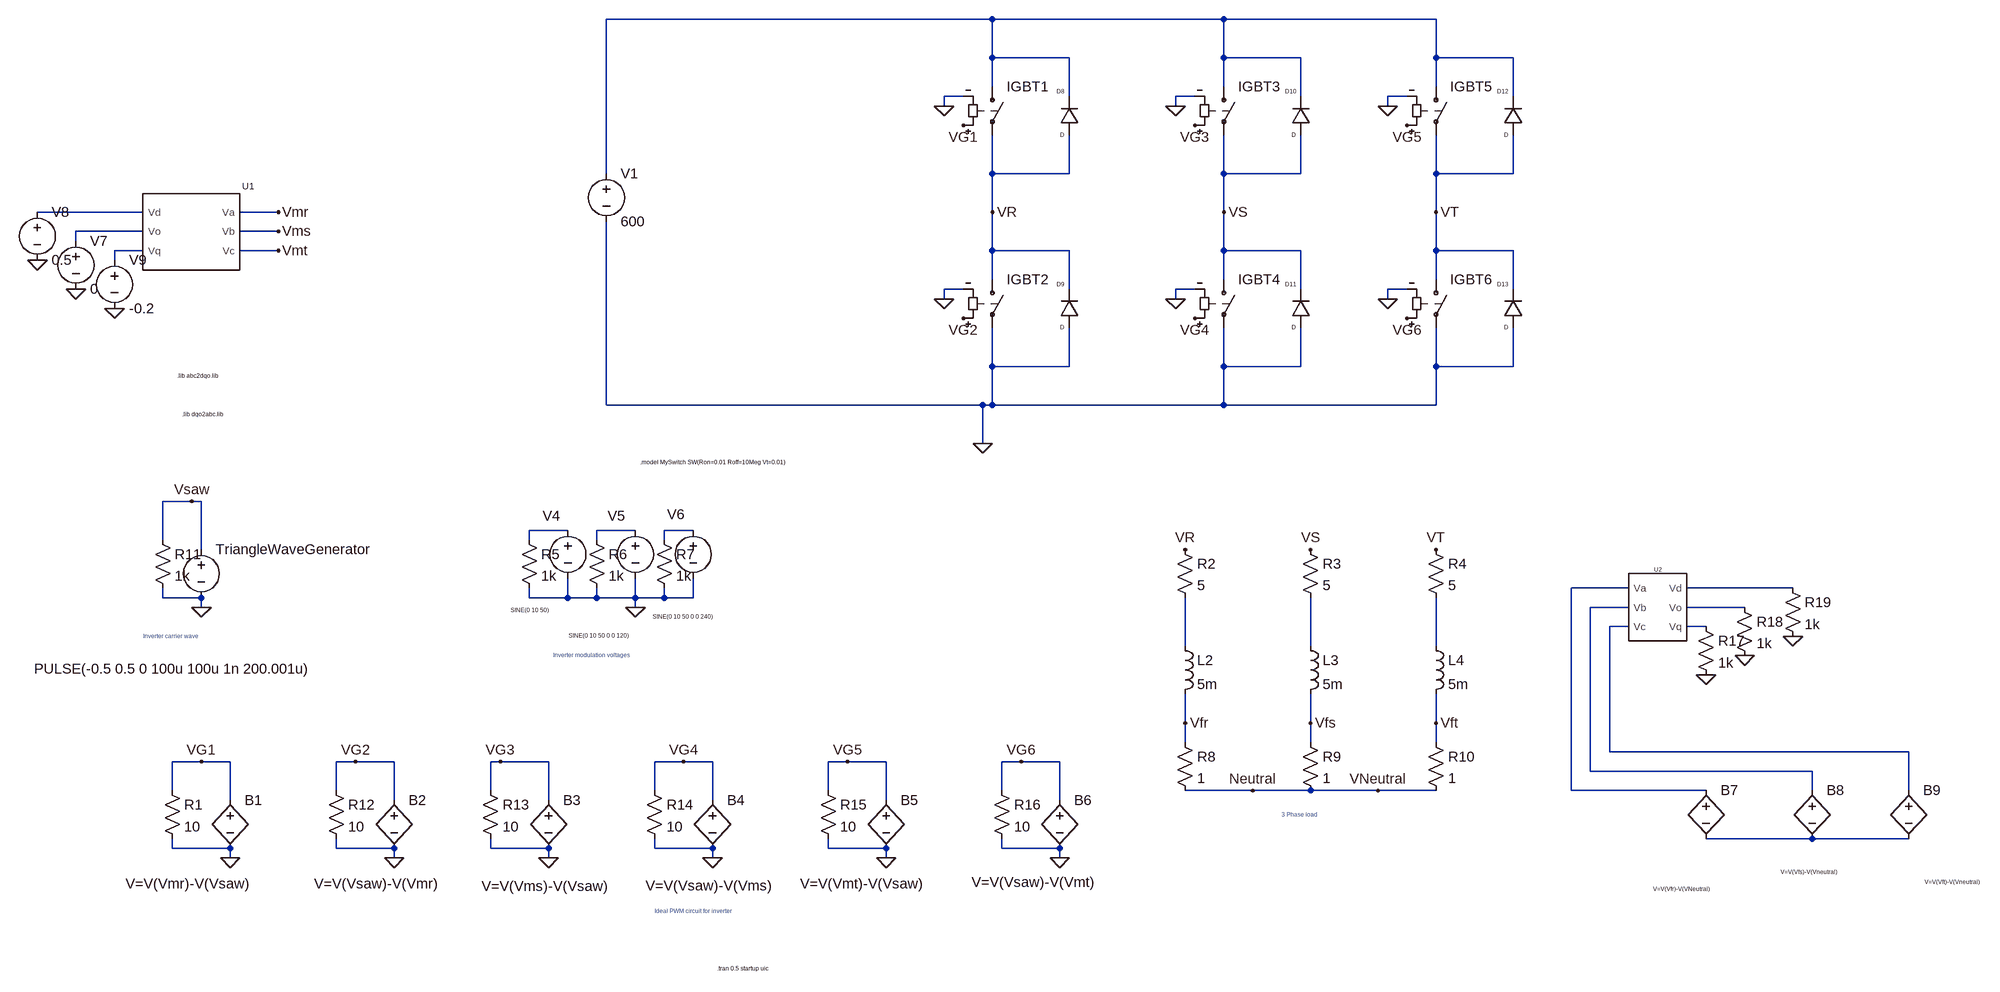
[diagram p0: schematic dqoabc_abcdqo_inverter1.asc]
dqoabc_abcdqo_inverter1.asc, the LTspice schematic file:
Version 4
SHEET 1 3872 1864
WIRE 1456 -32 816 -32
WIRE 1840 -32 1456 -32
WIRE 2192 -32 1840 -32
WIRE 1456 32 1456 -32
WIRE 1584 32 1456 32
WIRE 1840 32 1840 -32
WIRE 1968 32 1840 32
WIRE 2192 32 2192 -32
WIRE 2320 32 2192 32
WIRE 1456 80 1456 32
WIRE 1840 80 1840 32
WIRE 2192 80 2192 32
WIRE 1408 96 1376 96
WIRE 1584 96 1584 32
WIRE 1792 96 1760 96
WIRE 1968 96 1968 32
WIRE 2144 96 2112 96
WIRE 2320 96 2320 32
WIRE 1376 112 1376 96
WIRE 1760 112 1760 96
WIRE 2112 112 2112 96
WIRE 816 224 816 -32
WIRE 1456 224 1456 160
WIRE 1584 224 1584 160
WIRE 1584 224 1456 224
WIRE 1840 224 1840 160
WIRE 1968 224 1968 160
WIRE 1968 224 1840 224
WIRE 2192 224 2192 160
WIRE 2320 224 2320 160
WIRE 2320 224 2192 224
WIRE 48 288 -128 288
WIRE 272 288 208 288
WIRE 1456 288 1456 224
WIRE 1840 288 1840 224
WIRE 2192 288 2192 224
WIRE 48 320 -64 320
WIRE 272 320 208 320
WIRE -64 336 -64 320
WIRE 48 352 0 352
WIRE 272 352 208 352
WIRE 1456 352 1456 288
WIRE 1584 352 1456 352
WIRE 1840 352 1840 288
WIRE 1968 352 1840 352
WIRE 2192 352 2192 288
WIRE 2320 352 2192 352
WIRE 0 368 0 352
WIRE 1456 400 1456 352
WIRE 1840 400 1840 352
WIRE 2192 400 2192 352
WIRE 1408 416 1376 416
WIRE 1584 416 1584 352
WIRE 1792 416 1760 416
WIRE 1968 416 1968 352
WIRE 2144 416 2112 416
WIRE 2320 416 2320 352
WIRE 1376 432 1376 416
WIRE 1760 432 1760 416
WIRE 2112 432 2112 416
WIRE 1456 544 1456 480
WIRE 1584 544 1584 480
WIRE 1584 544 1456 544
WIRE 1840 544 1840 480
WIRE 1968 544 1968 480
WIRE 1968 544 1840 544
WIRE 2192 544 2192 480
WIRE 2320 544 2320 480
WIRE 2320 544 2192 544
WIRE 816 608 816 304
WIRE 1440 608 816 608
WIRE 1456 608 1456 544
WIRE 1456 608 1440 608
WIRE 1840 608 1840 544
WIRE 1840 608 1456 608
WIRE 2192 608 2192 544
WIRE 2192 608 1840 608
WIRE 1440 672 1440 608
WIRE 128 768 80 768
WIRE 144 768 128 768
WIRE 752 816 688 816
WIRE 864 816 800 816
WIRE 960 816 912 816
WIRE 80 832 80 768
WIRE 688 832 688 816
WIRE 800 832 800 816
WIRE 912 832 912 816
WIRE 144 848 144 768
WIRE 2512 912 2416 912
WIRE 2784 912 2608 912
WIRE 80 928 80 912
WIRE 144 928 80 928
WIRE 688 928 688 912
WIRE 752 928 752 896
WIRE 752 928 688 928
WIRE 800 928 800 912
WIRE 800 928 752 928
WIRE 864 928 864 896
WIRE 864 928 800 928
WIRE 912 928 912 912
WIRE 912 928 864 928
WIRE 960 928 960 896
WIRE 960 928 912 928
WIRE 144 944 144 928
WIRE 864 944 864 928
WIRE 2512 944 2448 944
WIRE 2704 944 2608 944
WIRE 2512 976 2480 976
WIRE 2640 976 2608 976
WIRE 1776 1008 1776 928
WIRE 1984 1008 1984 928
WIRE 2192 1008 2192 928
WIRE 1776 1136 1776 1088
WIRE 1984 1136 1984 1088
WIRE 2192 1136 2192 1088
WIRE 1776 1168 1776 1136
WIRE 1984 1168 1984 1136
WIRE 2192 1168 2192 1136
WIRE 2480 1184 2480 976
WIRE 2976 1184 2480 1184
WIRE 144 1200 96 1200
WIRE 192 1200 144 1200
WIRE 400 1200 368 1200
WIRE 464 1200 400 1200
WIRE 640 1200 624 1200
WIRE 720 1200 640 1200
WIRE 944 1200 896 1200
WIRE 992 1200 944 1200
WIRE 1216 1200 1184 1200
WIRE 1280 1200 1216 1200
WIRE 1504 1200 1472 1200
WIRE 1568 1200 1504 1200
WIRE 2448 1216 2448 944
WIRE 2816 1216 2448 1216
WIRE 96 1248 96 1200
WIRE 368 1248 368 1200
WIRE 624 1248 624 1200
WIRE 896 1248 896 1200
WIRE 1184 1248 1184 1200
WIRE 1472 1248 1472 1200
WIRE 1888 1248 1776 1248
WIRE 1984 1248 1888 1248
WIRE 2096 1248 1984 1248
WIRE 2192 1248 2096 1248
WIRE 2416 1248 2416 912
WIRE 2640 1248 2416 1248
WIRE 2816 1248 2816 1216
WIRE 2976 1248 2976 1184
WIRE 192 1264 192 1200
WIRE 464 1264 464 1200
WIRE 720 1264 720 1200
WIRE 992 1264 992 1200
WIRE 1280 1264 1280 1200
WIRE 1568 1264 1568 1200
WIRE 2816 1328 2640 1328
WIRE 2976 1328 2816 1328
WIRE 96 1344 96 1328
WIRE 192 1344 96 1344
WIRE 368 1344 368 1328
WIRE 464 1344 368 1344
WIRE 624 1344 624 1328
WIRE 720 1344 624 1344
WIRE 896 1344 896 1328
WIRE 992 1344 896 1344
WIRE 1184 1344 1184 1328
WIRE 1280 1344 1184 1344
WIRE 1472 1344 1472 1328
WIRE 1568 1344 1472 1344
WIRE 192 1360 192 1344
WIRE 464 1360 464 1344
WIRE 720 1360 720 1344
WIRE 992 1360 992 1344
WIRE 1280 1360 1280 1344
WIRE 1568 1360 1568 1344
FLAG 1376 112 0
FLAG 1408 144 VG1
FLAG 1376 432 0
FLAG 1408 464 VG2
FLAG 1760 112 0
FLAG 1792 144 VG3
FLAG 1760 432 0
FLAG 1792 464 VG4
FLAG 2112 112 0
FLAG 2144 144 VG5
FLAG 2112 432 0
FLAG 2144 464 VG6
FLAG 1456 288 VR
FLAG 1840 288 VS
FLAG 2192 288 VT
FLAG 1776 848 VR
FLAG 1984 848 VS
FLAG 2192 848 VT
FLAG 1888 1248 Neutral
FLAG 144 944 0
FLAG 128 768 Vsaw
FLAG 272 288 Vmr
FLAG 272 320 Vms
FLAG 272 352 Vmt
FLAG 144 1200 VG1
FLAG 400 1200 VG2
FLAG 640 1200 VG3
FLAG 944 1200 VG4
FLAG 1216 1200 VG5
FLAG 1504 1200 VG6
FLAG 864 944 0
FLAG 192 1360 0
FLAG 464 1360 0
FLAG 720 1360 0
FLAG 992 1360 0
FLAG 1280 1360 0
FLAG 1568 1360 0
FLAG -128 368 0
FLAG -64 416 0
FLAG 0 448 0
FLAG 1776 1136 Vfr
FLAG 1984 1136 Vfs
FLAG 2192 1136 Vft
FLAG 2640 1056 0
FLAG 2704 1024 0
FLAG 2784 992 0
FLAG 2096 1248 VNeutral
FLAG 1440 672 0
SYMBOL sw 1456 64 R0
SYMATTR InstName IGBT1
SYMATTR Value ""
SYMATTR SpiceModel MySwitch
SYMBOL diode 1600 160 R180
WINDOW 0 24 72 Left 0
WINDOW 3 24 0 Left 0
SYMATTR InstName D8
SYMBOL sw 1456 384 R0
SYMATTR InstName IGBT2
SYMATTR Value ""
SYMATTR SpiceModel MySwitch
SYMBOL diode 1600 480 R180
WINDOW 0 24 72 Left 0
WINDOW 3 24 0 Left 0
SYMATTR InstName D9
SYMBOL sw 1840 64 R0
SYMATTR InstName IGBT3
SYMATTR Value ""
SYMATTR SpiceModel MySwitch
SYMBOL diode 1984 160 R180
WINDOW 0 24 72 Left 0
WINDOW 3 24 0 Left 0
SYMATTR InstName D10
SYMBOL sw 1840 384 R0
SYMATTR InstName IGBT4
SYMATTR Value ""
SYMATTR SpiceModel MySwitch
SYMBOL diode 1984 480 R180
WINDOW 0 24 72 Left 0
WINDOW 3 24 0 Left 0
SYMATTR InstName D11
SYMBOL sw 2192 64 R0
SYMATTR InstName IGBT5
SYMATTR Value ""
SYMATTR SpiceModel MySwitch
SYMBOL diode 2336 160 R180
WINDOW 0 24 72 Left 0
WINDOW 3 24 0 Left 0
SYMATTR InstName D12
SYMBOL sw 2192 384 R0
SYMATTR InstName IGBT6
SYMATTR Value ""
SYMATTR SpiceModel MySwitch
SYMBOL diode 2336 480 R180
WINDOW 0 24 72 Left 0
WINDOW 3 24 0 Left 0
SYMATTR InstName D13
SYMBOL res 1760 832 R0
SYMATTR InstName R2
SYMATTR Value 5
SYMBOL res 1968 832 R0
SYMATTR InstName R3
SYMATTR Value 5
SYMBOL res 2176 832 R0
SYMATTR InstName R4
SYMATTR Value 5
SYMBOL voltage 144 832 R0
WINDOW 123 0 0 Left 0
WINDOW 39 0 0 Left 0
WINDOW 3 -277 214 Left 2
SYMATTR InstName TriangleWaveGenerator
SYMATTR Value PULSE(-0.5 0.5 0 100u 100u 1n 200.001u)
SYMBOL voltage 752 800 R0
WINDOW 3 -95 149 Left 0
WINDOW 123 0 0 Left 0
WINDOW 39 0 0 Left 0
WINDOW 0 -42 -8 Left 2
SYMATTR Value SINE(0 10 50)
SYMATTR InstName V4
SYMBOL voltage 864 800 R0
WINDOW 3 -111 191 Left 0
WINDOW 123 0 0 Left 0
WINDOW 39 0 0 Left 0
WINDOW 0 -46 -8 Left 2
SYMATTR Value SINE(0 10 50 0 0 120)
SYMATTR InstName V5
SYMBOL voltage 960 800 R0
WINDOW 3 -67 160 Left 0
WINDOW 123 0 0 Left 0
WINDOW 39 0 0 Left 0
WINDOW 0 -43 -10 Left 2
SYMATTR Value SINE(0 10 50 0 0 240)
SYMATTR InstName V6
SYMBOL res 64 816 R0
SYMATTR InstName R11
SYMATTR Value 1k
SYMBOL bv 192 1248 R0
WINDOW 3 -173 155 Left 2
SYMATTR InstName B1
SYMATTR Value V=V(Vmr)-V(Vsaw)
SYMBOL res 80 1232 R0
SYMATTR InstName R1
SYMATTR Value 10
SYMBOL bv 464 1248 R0
WINDOW 3 -133 155 Left 2
SYMATTR InstName B2
SYMATTR Value V=V(Vsaw)-V(Vmr)
SYMBOL res 352 1232 R0
SYMATTR InstName R12
SYMATTR Value 10
SYMBOL bv 720 1248 R0
WINDOW 3 -111 159 Left 2
SYMATTR InstName B3
SYMATTR Value V=V(Vms)-V(Vsaw)
SYMBOL res 608 1232 R0
SYMATTR InstName R13
SYMATTR Value 10
SYMBOL bv 992 1248 R0
WINDOW 3 -111 158 Left 2
SYMATTR InstName B4
SYMATTR Value V=V(Vsaw)-V(Vms)
SYMBOL res 880 1232 R0
SYMATTR InstName R14
SYMATTR Value 10
SYMBOL bv 1280 1248 R0
WINDOW 3 -143 155 Left 2
SYMATTR InstName B5
SYMATTR Value V=V(Vmt)-V(Vsaw)
SYMBOL res 1168 1232 R0
SYMATTR InstName R15
SYMATTR Value 10
SYMBOL bv 1568 1248 R0
WINDOW 3 -146 152 Left 2
SYMATTR InstName B6
SYMATTR Value V=V(Vsaw)-V(Vmt)
SYMBOL res 1456 1232 R0
SYMATTR InstName R16
SYMATTR Value 10
SYMBOL ind 1760 992 R0
SYMATTR InstName L2
SYMATTR Value 5m
SYMBOL ind 1968 992 R0
SYMATTR InstName L3
SYMATTR Value 5m
SYMBOL ind 2176 992 R0
SYMATTR InstName L4
SYMATTR Value 5m
SYMBOL res 672 816 R0
SYMATTR InstName R5
SYMATTR Value 1k
SYMBOL res 784 816 R0
SYMATTR InstName R6
SYMATTR Value 1k
SYMBOL res 896 816 R0
SYMATTR InstName R7
SYMATTR Value 1k
SYMBOL voltage -64 320 R0
WINDOW 123 0 0 Left 0
WINDOW 39 0 0 Left 0
SYMATTR InstName V7
SYMATTR Value 0
SYMBOL voltage -128 272 R0
WINDOW 123 0 0 Left 0
WINDOW 39 0 0 Left 0
SYMATTR InstName V8
SYMATTR Value 0.5
SYMBOL voltage 0 352 R0
WINDOW 123 0 0 Left 0
WINDOW 39 0 0 Left 0
SYMATTR InstName V9
SYMATTR Value -0.2
SYMBOL abc2dqo 2560 944 R0
SYMATTR InstName U2
SYMBOL res 1760 1152 R0
SYMATTR InstName R8
SYMATTR Value 1
SYMBOL res 1968 1152 R0
SYMATTR InstName R9
SYMATTR Value 1
SYMBOL res 2176 1152 R0
SYMATTR InstName R10
SYMATTR Value 1
SYMBOL res 2624 960 R0
SYMATTR InstName R17
SYMATTR Value 1k
SYMBOL res 2688 928 R0
SYMATTR InstName R18
SYMATTR Value 1k
SYMBOL res 2768 896 R0
SYMATTR InstName R19
SYMATTR Value 1k
SYMBOL bv 2640 1232 R0
WINDOW 3 -88 180 Left 0
SYMATTR Value V=V(Vfr)-V(VNeutral)
SYMATTR InstName B7
SYMBOL bv 2816 1232 R0
WINDOW 3 -52 152 Left 0
SYMATTR Value V=V(Vfs)-V(Vneutral)
SYMATTR InstName B8
SYMBOL bv 2976 1232 R0
WINDOW 3 27 168 Left 0
SYMATTR Value V=V(Vft)-V(Vneutral)
SYMATTR InstName B9
SYMBOL dqabc 128 320 R0
SYMATTR InstName U1
SYMBOL voltage 816 208 R0
WINDOW 123 0 0 Left 0
WINDOW 39 0 0 Left 0
SYMATTR InstName V1
SYMATTR Value 600
TEXT 1000 1544 Left 0 !.tran 0.5 startup uic
TEXT 872 704 Left 0 !.model MySwitch SW(Ron=0.01 Roff=10Meg Vt=0.01)
TEXT 728 1024 Left 0 ;Inverter modulation voltages
TEXT 48 992 Left 0 ;Inverter carrier wave
TEXT 1936 1288 Left 0 ;3 Phase load
TEXT 896 1448 Left 0 ;Ideal PWM circuit for inverter
TEXT 112 624 Left 0 !.lib dqo2abc.lib
TEXT 104 560 Left 0 !.lib abc2dqo.lib

The netlist it stands for:
* dqoabc_abcdqo_inverter1.asc
S§IGBT1 N001 VR VG1 0 MySwitch
D8 VR N001 D
S§IGBT2 VR 0 VG2 0 MySwitch
D9 0 VR D
S§IGBT3 N001 VS VG3 0 MySwitch
D10 VS N001 D
S§IGBT4 VS 0 VG4 0 MySwitch
D11 0 VS D
S§IGBT5 N001 VT VG5 0 MySwitch
D12 VT N001 D
S§IGBT6 VT 0 VG6 0 MySwitch
D13 0 VT D
R2 VR N014 5
R3 VS N015 5
R4 VT N016 5
V§TriangleWaveGenerator Vsaw 0 PULSE(-0.5 0.5 0 100u 100u 1n 200.001u)
V4 N005 0 SINE(0 10 50)
V5 N006 0 SINE(0 10 50 0 0 120)
V6 N007 0 SINE(0 10 50 0 0 240)
R11 Vsaw 0 1k
B1 VG1 0 V=V(Vmr)-V(Vsaw)
R1 VG1 0 10
B2 VG2 0 V=V(Vsaw)-V(Vmr)
R12 VG2 0 10
B3 VG3 0 V=V(Vms)-V(Vsaw)
R13 VG3 0 10
B4 VG4 0 V=V(Vsaw)-V(Vms)
R14 VG4 0 10
B5 VG5 0 V=V(Vmt)-V(Vsaw)
R15 VG5 0 10
B6 VG6 0 V=V(Vsaw)-V(Vmt)
R16 VG6 0 10
L2 N014 Vfr 5m
L3 N015 Vfs 5m
L4 N016 Vft 5m
R5 N005 0 1k
R6 N006 0 1k
R7 N007 0 1k
V7 N003 0 0
V8 N002 0 0.5
V9 N004 0 -0.2
XU2 N008 N010 N012 N009 N011 N013 abc2dqo  ; pins Va Vb Vc Vd Vo Vq
R8 Vfr VNeutral 1
R9 Vfs VNeutral 1
R10 Vft VNeutral 1
R17 N013 0 1k
R18 N011 0 1k
R19 N009 0 1k
B7 N008 N017 V=V(Vfr)-V(VNeutral)
B8 N010 N017 V=V(Vfs)-V(Vneutral)
B9 N012 N017 V=V(Vft)-V(Vneutral)
XU1 N002 N003 N004 Vmr Vms Vmt dqo2abc  ; pins Vd Vo Vq Va Vb Vc
V1 N001 0 600
.model D D
.lib standard.dio
.tran 0.5 startup uic
.model MySwitch SW(Ron=0.01 Roff=10Meg Vt=0.01)
* Inverter modulation voltages
* Inverter carrier wave
* 3 Phase load
* Ideal PWM circuit for inverter
.lib dqo2abc.lib
.lib abc2dqo.lib
.backanno
.end